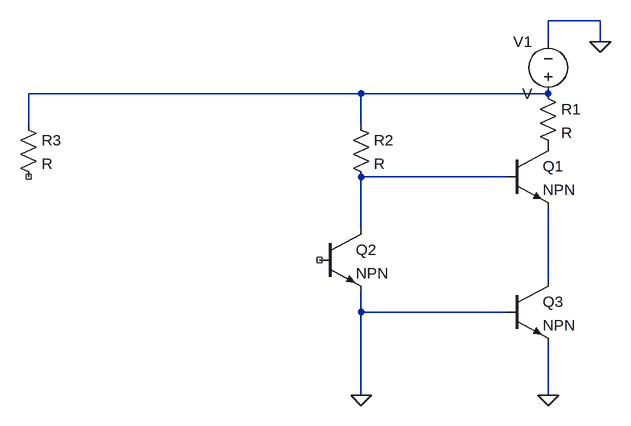
[diagram p0: schematic tr-nand.asc]
tr-nand.asc, the LTspice schematic file:
Version 4.1
SHEET 1 880 680
WIRE 480 -128 400 -128
WIRE 400 -96 400 -128
WIRE 480 -96 480 -128
WIRE 112 -16 -400 -16
WIRE 400 -16 112 -16
WIRE -400 32 -400 -16
WIRE 112 32 112 -16
WIRE 336 112 112 112
WIRE 112 192 112 112
WIRE 400 272 400 160
WIRE 112 320 112 288
WIRE 336 320 112 320
WIRE 112 448 112 320
WIRE 400 448 400 368
FLAG 480 -96 0
FLAG 400 448 0
FLAG 112 448 0
SYMBOL voltage 400 0 R180
WINDOW 0 24 96 Left 2
WINDOW 3 24 16 Left 2
SYMATTR InstName V1
SYMBOL res 384 -32 R0
SYMATTR InstName R1
SYMBOL res 96 16 R0
SYMATTR InstName R2
SYMBOL res -416 16 R0
SYMATTR InstName R3
SYMBOL npn 336 64 R0
SYMATTR InstName Q1
SYMBOL npn 48 192 R0
SYMATTR InstName Q2
SYMBOL npn 336 272 R0
SYMATTR InstName Q3

The netlist it stands for:
* tr-nand.asc
V1 N001 0 V
R1 N001 P001 R
R2 N001 N002 R
R3 N001 NC_01 R
Q1 P001 N002 N003 0 NPN
Q2 N002 NC_02 0 0 NPN
Q3 N003 0 0 0 NPN
.model NPN NPN
.model PNP PNP
.lib standard.bjt
.backanno
.end